# EasyEDA Pro project ProPrj_共享电动车中控.epro, board PCB5
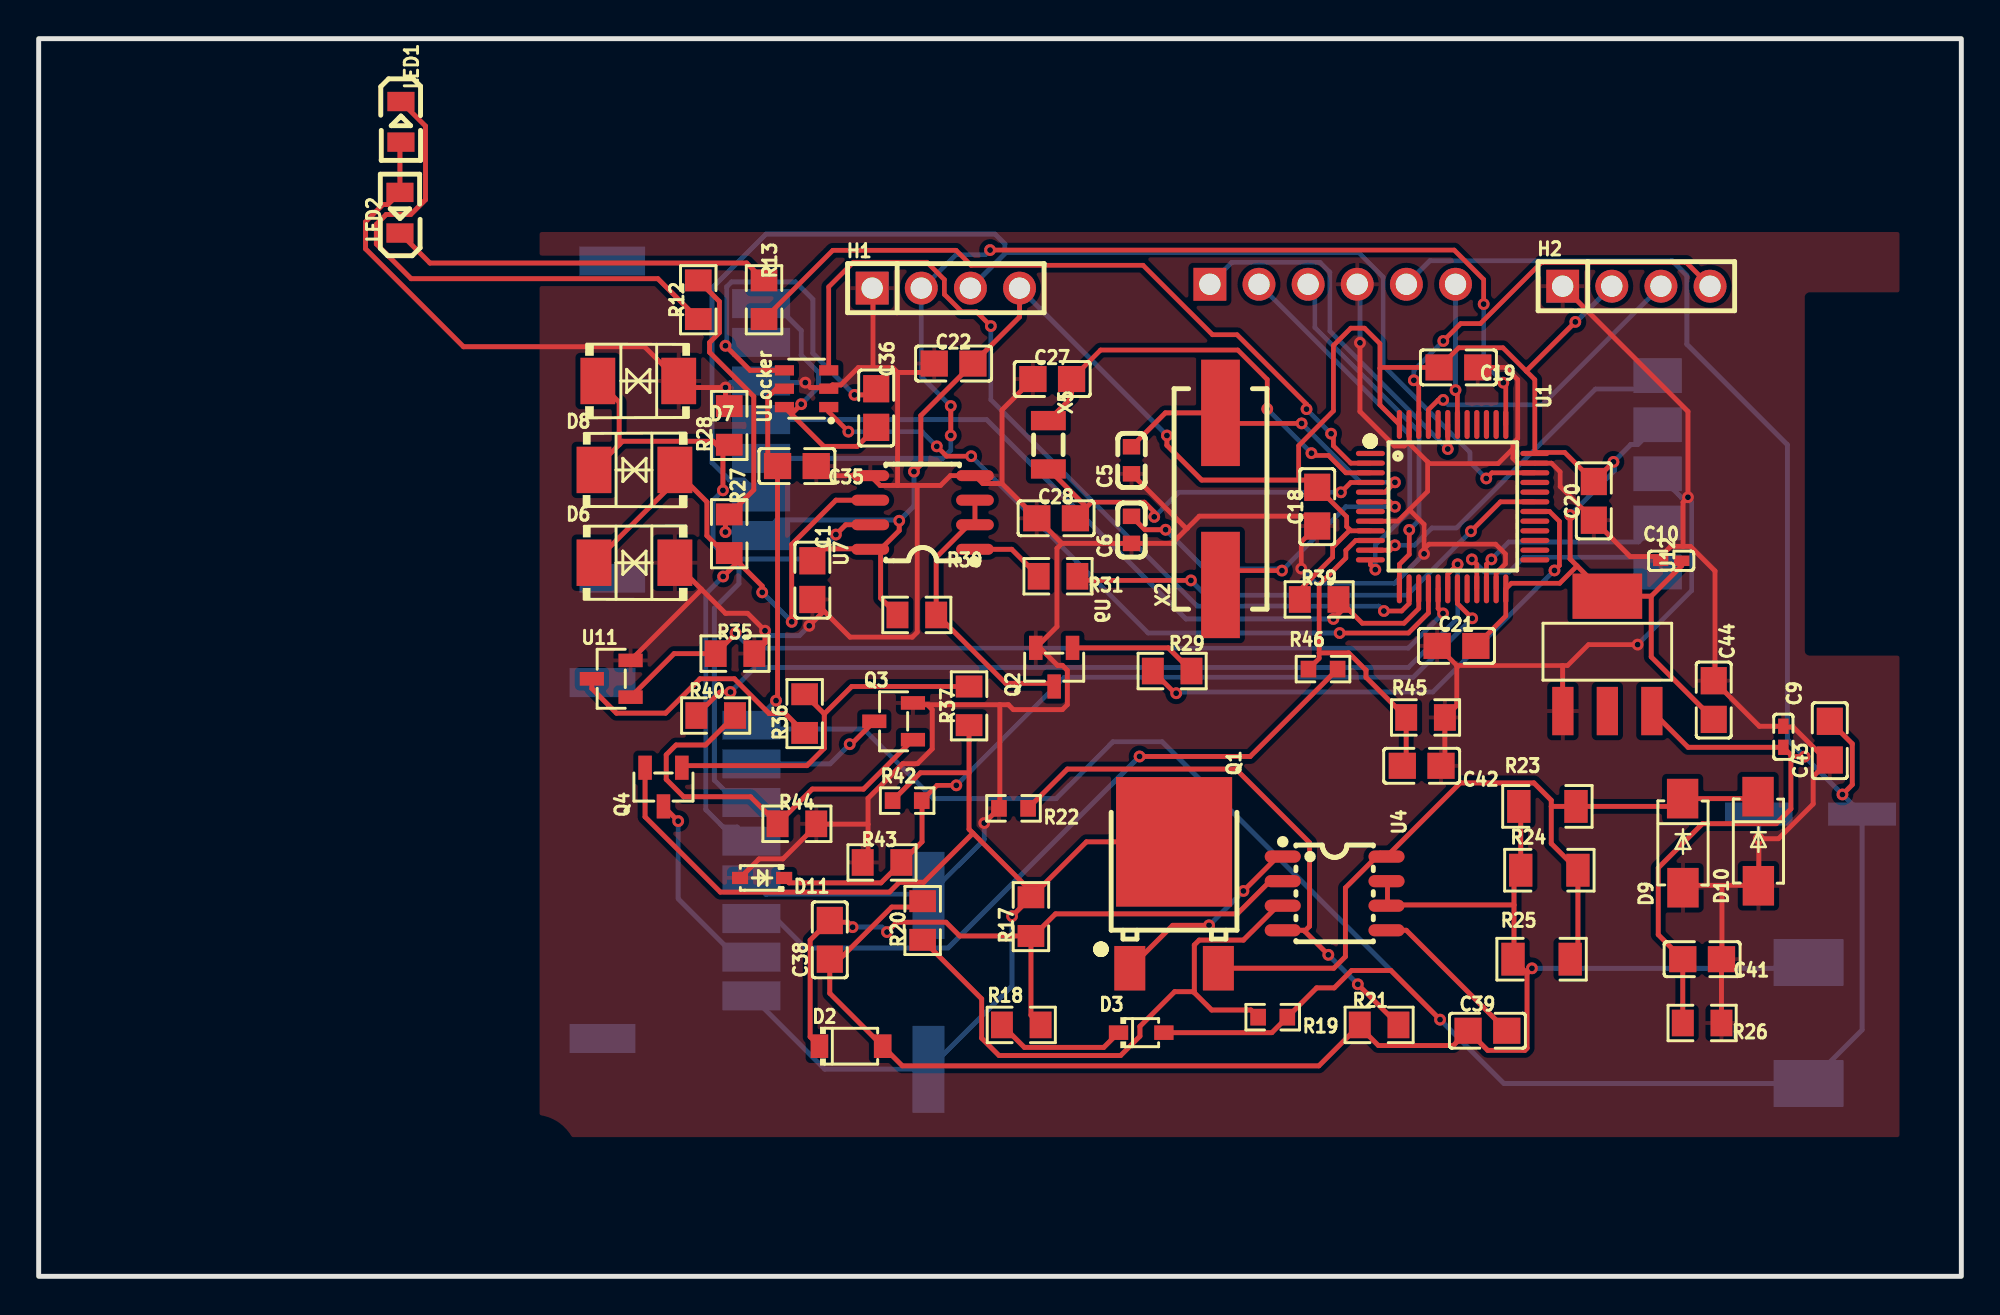
[diagram p11: board, top side]
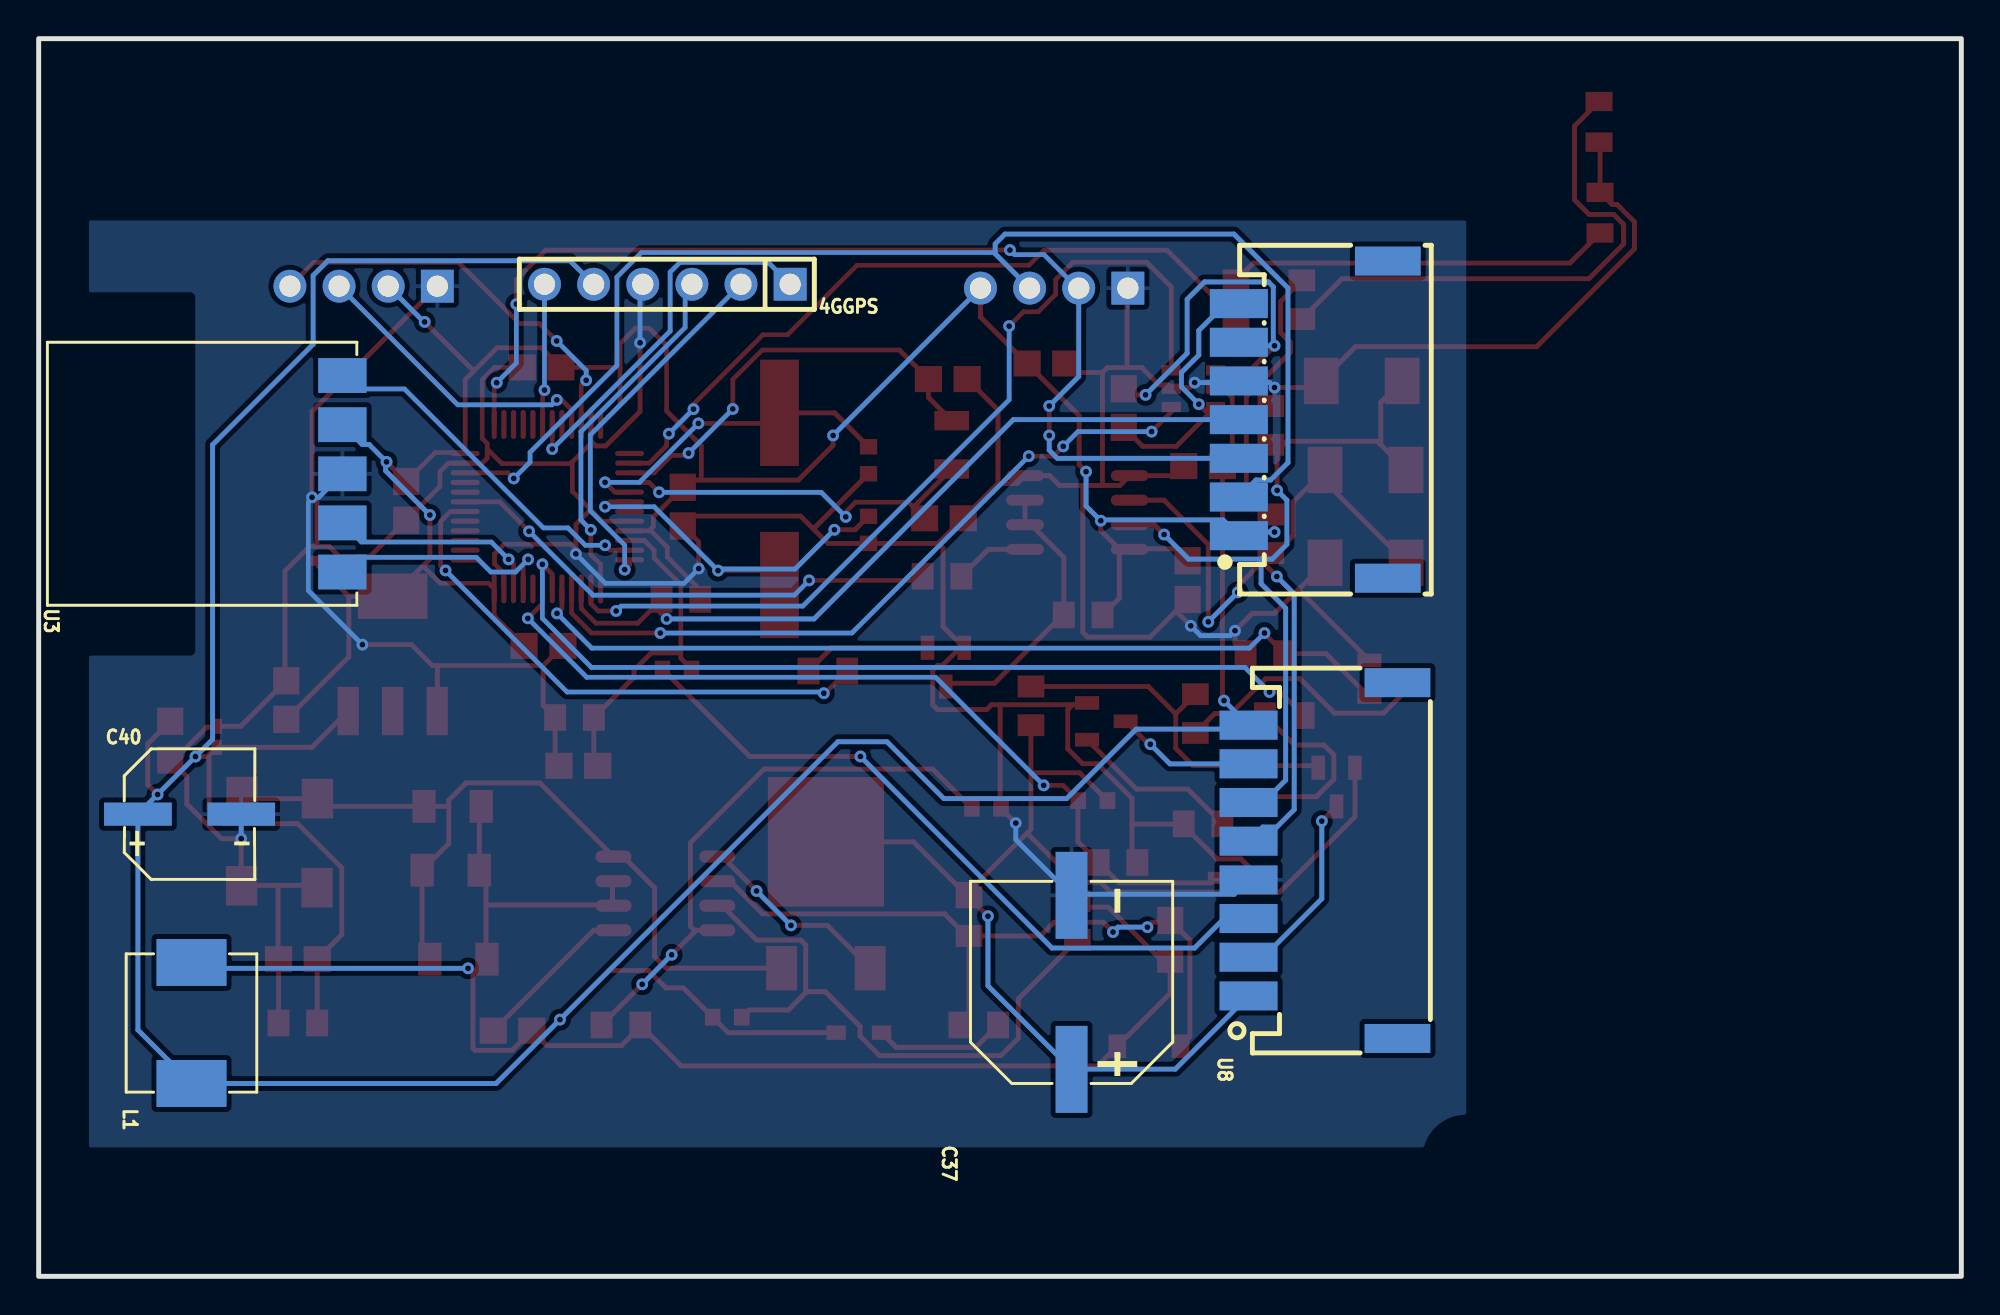
[diagram p12: board, bottom side, seen from below]

Outline 99.4 x 64 mm; copper layers: Top Layer, Bottom Layer. Coordinates in mm from the lower left corner of the outline.
Outline path: rectangle 0,64 99.4,0
Stack: Top Layer 0.035mm / Dielectric1 1.51mm FR4 er 4.5 / Bottom Layer 0.035mm

## Design rules (mm)
template: JLCPCB Capability(Two Layers Board)
spacing copperThickness1oz (default): track to track 0.102, other pairs 0.152 to 0.3
spacing copperThickness2oz: track to track 0.203, other pairs 0.152 to 0.3
track width copperThickness1oz (default): min 0.127, default 0.254, max 2.54
track width copperThickness2oz: min 0.203, default 0.254, max 2.54
differential pair differentialPair (default): width min 0.127, default 0.254, max 2.54; gap min 0.152, default 0.152
via viaSize (default): diameter min 0.5, default 0.61, max 10; hole min 0.3, default 0.305, max 6.3
net +5V uses copperThickness2oz
net GND uses copperThickness2oz
net 3V3 uses copperThickness2oz
net AGND uses copperThickness2oz
net VBAT uses copperThickness2oz
net DIANMEN uses copperThickness2oz
net VDC+ uses copperThickness2oz
net SPK1 uses copperThickness2oz
net WHEEL uses copperThickness2oz

## Placement (name value [footprint] x y rotation side)
4GGPS  X6511WV-06H-C60D30  [HDR-TH_6P-P2.54-V-M]  66.9 51.3 0 bottom
C1  100nF  [C0805]  40 36 270 top
C5  22pF  [C0603]  56.5 42.2 90 top
C6  22pF  [C0603]  56.5 38.6 90 top
C9  10uF  [C0402]  90.2 27.9 270 top
C10  10uF  [C0402]  84.4 37 0 top
C18  100nF  [C0805]  66.1 39.8 90 top
C19  100nF  [C0805]  73.4 47 180 top
C20  100nF  [C0805]  80.4 40.1 90 top
C21  100nF  [C0805]  73.3 32.6 0 top
C22  100nF  [C0805]  47.3 47.2 0 top
C27  12pF  [C0805]  52.4 46.4 0 top
C28  12pF  [C0805]  52.6 39.2 0 top
C35  4.7uF  [C0805]  39.2 41.9 180 top
C36  100nF  [C0805]  43.3 44.9 270 top
C37  47uF  [CAP-SMD_BD10.0-L10.3-W10.3-LS11.3-FD]  46 15.2 90 bottom
C38  2.2uF  [C0805]  40.9 17.4 90 top
C39  4.7uF  [C0805]  74.9 12.7 0 top
C40  220uF  [CAP-SMD_BD6.3-L6.6-W6.6-FD]  91.6 23.9 180 bottom
C41  100nF  [C0805]  86 16.4 180 top
C42  100nF  [C0805]  71.5 26.4 180 top
C43  100nF  [C0805]  92.6 27.7 90 top
C44  100nF  [C0805]  86.6 29.8 270 top
D2  BZT52B12  [SOD-123_L2.7-W1.6-LS3.7-RD]  42 11.9 0 top
D3  1N4148WS  [SOD-323_L1.8-W1.3-LS2.5-RD]  57 12.6 0 top
D6  SMBJ6.5CA  [SMB_L4.6-W3.5-LS5.3-BI]  30.8 36.9 0 top
D7  SMBJ6.5CA  [SMB_L4.6-W3.5-LS5.3-BI]  31 46.3 180 top
D8  SMBJ6.5CA  [SMB_L4.6-W3.5-LS5.3-BI]  30.8 41.7 0 top
D9  SS310  [SMA_L4.3-W2.6-LS5.0-FD]  85 22.4 90 top
D10  SS310  [SMA_L4.3-W2.6-LS5.0-FD]  88.9 22.5 90 top
D11  BZT52C3V3S  [SOD-323_L1.7-W1.3-LS2.6-RD]  37.4 20.6 180 top
H1  -  [HDR-TH_4P-P2.54-V-M]  46.9 51.1 0 top
H2  -  [HDR-TH_4P-P2.54-V-M]  82.6 51.2 0 top
L1  47uH  [IND-SMD_L7.0-W6.6_FXL0630]  91.5 13.1 90 bottom
LED1  NCD0805R1  [LED0805-R-RD]  18.73 59.7 270 top
LED2  KT-0805G  [LED0805-R-RD]  18.68 55 90 top
Q1  TX15N10B  [TO-252_L6.5-W6.1-P4.58-LS9.9-BR]  58.7 19.2 270 top
Q2  SS8050  [SOT-23-3_L2.9-W1.3-P1.90-LS2.4-BR]  52.5 31.5 90 top
Q3  SS8050  [SOT-23-3_L2.9-W1.3-P1.90-LS2.4-BR]  44.2 28.7 0 top
Q4  PJM10H01PSA  [SOT-23-3_L2.9-W1.3-P0.95-LS2.4-BR]  32.3 25.3 90 top
R12  1kΩ  [R0805]  34.1 50.5 90 top
R13  1kΩ  [R0805]  37.5 50.5 270 top
R17  51kΩ  [R0805]  51.3 18.6 90 top
R18  100Ω  [R0805]  50.8 13 0 top
R19  62kΩ  [R0603]  63.8 13.4 180 top
R20  4.99kΩ  [R0805]  45.7 18.4 90 top
R21  4.99kΩ  [R0805]  69.3 13 0 top
R22  62kΩ  [R0603]  50.4 24.2 180 top
R23  100mΩ  [R1206]  78 24.3 0 top
R24  100mΩ  [R1206]  78.1 21 0 top
R25  100mΩ  [R1206]  77.7 16.4 0 top
R26  2.2kΩ  [R0805]  86 13.1 180 top
R27  4.7kΩ  [R0805]  35.7 38.4 270 top
R28  4.7kΩ  [R0805]  35.7 44 90 top
R29  4.7kΩ  [R0805]  58.6 31.3 0 top
R30  4.7kΩ  [R0805]  45.4 34.2 180 top
R31  1kΩ  [R0805]  52.7 36.2 180 top
R35  10kΩ  [R0805]  36 32.2 0 top
R36  51kΩ  [R0805]  39.6 29.1 90 top
R37  10kΩ  [R0805]  48.1 29.5 90 top
R39  10kΩ  [R0805]  66.2 35 0 top
R40  4.7kΩ  [R0805]  35 29 0 top
R42  62kΩ  [R0603]  44.9 24.6 0 top
R43  2kΩ  [R0805]  43.6 21.4 0 top
R44  10kΩ  [R0805]  39.2 23.4 0 top
R45  10kΩ  [R0805]  71.7 28.9 0 top
R46  0Ω  [R0603]  66.4 31.4 0 top
U1  STM32F103C8T6  [LQFP-48_L7.0-W7.0-P0.50-LS9.0-BL]  73.1 39.8 270 top
U3  VG6328A  [COMM-SMD_VG6328A]  83.7 41.5 90 bottom
U4  TX4131L  [SOP-8_L4.9-W3.9-P1.27-LS6.0-BL]  67 19.8 270 top
U7  SP3485EN-L/TR  [SOIC-8_L5.0-W4.0-P1.27-LS6.0-BL]  45.7 39.5 90 top
U8  ZX-HY2.0-8PWT  [CONN-SMD_8P-P2.00_WAFER-HY2.0-8PWB]  33 21.5 90 bottom
U9  ZX-HY2.0-7PWT  [CONN-SMD_7P-P2.00_ZX-HY2.0-7PWT]  33.5 44.3 90 bottom
U11  BSS123  [SOT-23-3_L2.9-W1.3-P1.90-LS2.4-BR]  29.6 30.9 0 top
U12  AMS1117-3.3  [SOT-223-3_L6.5-W3.4-P2.30-LS7.0-BR]  81.1 32.2 270 top
ULocker  T1016H  [SOT-23-6_L2.9-W1.7-P0.95-LS2.8-BL]  39.7 45.9 90 top
X2  8MHz  [CRYSTAL-SMD_L11.5-W4.8-LS12.7]  61.1 40.2 90 top
X5  32.768kHz  [FC-135R_L3.2-W1.5]  52.2 43 270 top

## Footprints (pads in the part's own frame, mm; a bottom-side part is the same pattern mirrored in y, then rotated)
C0402
  rect 0.79x0.54 smd: 1(-0.545,0) 2(0.545,0)
C0603
  rect 0.8x0.9 smd: 1(-0.7,0) 2(0.7,0)
C0805
  rect 1.41x1.35 smd: 1(-1,0) 2(1,0)
CAP-SMD_BD6.3-L6.6-W6.6-FD
  rect 3.5x1.2 smd: 1(-2.67,0) 2(2.67,0)
CAP-SMD_BD10.0-L10.3-W10.3-LS11.3-FD
  rect 4.5x1.65 smd: 1(-4.5,0) 2(4.5,0)
COMM-SMD_VG6328A
  rect 1.8x2.5 smd: 1(-5.08,0) 2(-2.54,0) 3(0,0) 4(2.54,0) 5(5.08,0)
CONN-SMD_7P-P2.00_ZX-HY2.0-7PWT
  rect 1.5x3 smd: 1(-6,3.85) 2(-4,3.85) 3(-2,3.85) 4(0,3.85) 5(2,3.85) 6(4,3.85) 7(6,3.85)
  rect 1.5x3.4 smd: 8(8.2,-3.85) 9(-8.2,-3.85)
CONN-SMD_8P-P2.00_WAFER-HY2.0-8PWB
  rect 1.5x3 smd: 1(-7,3.85) 2(-5,3.85) 3(-3,3.85) 4(-1,3.85) 5(1,3.85) 6(3,3.85) 7(5,3.85) 8(7,3.85)
  rect 1.5x3.4 smd: 9(-9.2,-3.85) 10(9.2,-3.85)
CRYSTAL-SMD_L11.5-W4.8-LS12.7
  rect 5.5x2 smd: 1(-4.45,0) 2(4.45,0)
FC-135R_L3.2-W1.5
  rect 1x1.8 smd: 1(-1.25,0) 2(1.25,0)
HDR-TH_4P-P2.54-V-M
  rect 1.7x1.7 hole 1.1: 1(-3.81,0)
  round 1.7 hole 1.1: 2(-1.27,0) 3(1.27,0) 4(3.81,0)
HDR-TH_6P-P2.54-V-M
  rect 1.7x1.7 hole 1.1: 1(-6.35,0)
  round 1.7 hole 1.1: 2(-3.81,0) 3(-1.27,0) 4(1.27,0) 5(3.81,0) 6(6.35,0)
IND-SMD_L7.0-W6.6_FXL0630
  rect 2.424x3.62 smd: 1(3.128,0) 2(-3.128,0)
LED0805-R-RD
  rect 1x1.399 smd: 1(1.05,0) 2(-1.05,0)
LQFP-48_L7.0-W7.0-P0.50-LS9.0-BL
  oval 0.27x1.5 smd: 1(-2.75,-4.25) 2(-2.25,-4.25) 3(-1.75,-4.25) 4(-1.25,-4.25) 5(-0.75,-4.25) 6(-0.25,-4.25) 7(0.25,-4.25) 8(0.75,-4.25) 9(1.25,-4.25) 10(1.75,-4.25) 11(2.25,-4.25) 12(2.75,-4.25) 25(2.75,4.25) 26(2.25,4.25) 27(1.75,4.25) 28(1.25,4.25) 29(0.75,4.25) 30(0.25,4.25) 31(-0.25,4.25) 32(-0.75,4.25) 33(-1.25,4.25) 34(-1.75,4.25) 35(-2.25,4.25) 36(-2.75,4.25)
  oval 1.5x0.27 smd: 13(4.25,-2.75) 14(4.25,-2.25) 15(4.25,-1.75) 16(4.25,-1.25) 17(4.25,-0.75) 18(4.25,-0.25) 19(4.25,0.25) 20(4.25,0.75) 21(4.25,1.25) 22(4.25,1.75) 23(4.25,2.25) 24(4.25,2.75) 37(-4.25,2.75) 38(-4.25,2.25) 39(-4.25,1.75) 40(-4.25,1.25) 41(-4.25,0.75) 42(-4.25,0.25) 43(-4.25,-0.25) 44(-4.25,-0.75) 45(-4.25,-1.25) 46(-4.25,-1.75) 47(-4.25,-2.25) 48(-4.25,-2.75)
R0603
  rect 0.806x0.864 smd: 1(-0.753,0) 2(0.753,0)
R0805
  rect 1.133x1.377 smd: 1(-1,0) 2(1,0)
R1206
  rect 1.208x1.701 smd: 1(-1.479,0) 2(1.479,0)
SMA_L4.3-W2.6-LS5.0-FD
  rect 2.046x1.62 smd: 1(-2.304,-0.009) 2(2.304,0.009)
SMB_L4.6-W3.5-LS5.3-BI
  rect 1.8x2.4 smd: 1(-2.091,0) 2(2.091,0)
SOD-123_L2.7-W1.6-LS3.7-RD
  rect 0.91x1.22 smd: 1(-1.635,0) 2(1.635,0)
SOD-323_L1.7-W1.3-LS2.6-RD
  rect 0.83x0.63 smd: 1(-1.14,0) 2(1.14,0)
SOD-323_L1.8-W1.3-LS2.5-RD
  rect 1x0.75 smd: 1(-1.173,0) 2(1.173,0)
SOIC-8_L5.0-W4.0-P1.27-LS6.0-BL
  oval 0.569x1.95 smd: 1(-1.905,-2.705) 2(-0.635,-2.705) 3(0.635,-2.705) 4(1.905,-2.705) 5(1.905,2.705) 6(0.635,2.705) 7(-0.635,2.705) 8(-1.905,2.705)
SOP-8_L4.9-W3.9-P1.27-LS6.0-BL
  oval 0.63x1.865 smd: 1(-1.905,-2.683) 2(-0.635,-2.683) 3(0.635,-2.683) 4(1.905,-2.683) 5(1.905,2.683) 6(0.635,2.683) 7(-0.635,2.683) 8(-1.905,2.683)
SOT-23-3_L2.9-W1.3-P0.95-LS2.4-BR
  rect 1.25x0.7 smd: 1(1,-0.95) 2(1,0.95) 3(-1,0)
SOT-23-3_L2.9-W1.3-P1.90-LS2.4-BR
  rect 1.25x0.7 smd: 1(1,-0.95) 2(1,0.95) 3(-1,0)
SOT-23-6_L2.9-W1.7-P0.95-LS2.8-BL
  rect 0.532x0.99 smd: 1(-0.95,-1.145) 2(0,-1.145) 3(0.95,-1.145) 4(0.95,1.145) 5(0,1.145) 6(-0.95,1.145)
SOT-223-3_L6.5-W3.4-P2.30-LS7.0-BR
  rect 2.5x1.1 smd: 1(2.97,-2.3) 2(2.97,0) 3(2.97,2.3)
  rect 2.34x3.6 smd: 4(-2.97,0)
TO-252_L6.5-W6.1-P4.58-LS9.9-BR
  rect 2.3x1.6 smd: 1(3.268,-2.29) 3(3.267,2.29)
  rect 6.7x6 smd: 2(-3.268,0)

## Nets
As in the schematic, except:
$8N894: Q4.1 R36.2 R37.2

Pads without a net: U8 9 10; U9 8 9; U12 2

## Via types
v1: diameter 0.61, hole 0.305, Top Layer to Bottom Layer, 85 vias

## Routing (per net, layer and track width the routed paths; a pad name or vN(x,y) marks a point on that pad's centre or on a via; arc(x,y) is an arc through that point)
3V3: length 149.2
  Top Layer w0.243: 77.35,42.6 U1.36 ; 77.35,42.6 77.35,46.37 75.7,48.02 73.42,48.02 C19.2 69.39,47 69.34,46.96 ; 77.35,42.6 78.9,42.6 C20.2 ; U1.9 67.84,38.55 67.8,38.6 ; C18.2 67.62,39.28 67.62,38.77 67.8,38.6 ; 69.34,46.96 69.34,48.23 68.54,49.03 67.84,49.03 66.94,48.13 66.94,44.75 65.14,42.95 65.14,41.18 ; 69.34,46.96 69.34,45.06 U1.48 ; 79.53,36.74 78.64,35.84 76.14,35.84 U1.24 75.85,34.15 C21.2 ; 67.8,38.6 66.9,37.7 66.9,37.19 65.2,35.49 R39.1
  Top Layer w0.254: v1(79.18,39.37) 79.18,37.09 U12.4 83.37,35.17 ; v1(45.25,41.61) 45.61,41.97 45.61,44.51 C22.2 50.71,49.61 H1.4 ; R12.2 35.19,50.41 35.19,48.8 34.68,48.29 34.68,47.78 36.97,45.5 36.97,40.67 R27.1 35.5,39.2 v1(35.5,38.49) ; 43.02,37.62 43,37.59 ; 43.02,37.62 40.62,37.62 C1.1 ; 43.02,37.62 43.07,37.67 43.53,37.67 ; 76.91,46.81 v1(79.44,49.35) ; 83.37,35.17 84.94,36.75 C10.2 ; 83.37,35.17 83.37,32.03 C44.2 ; 43.53,37.67 43.53,35.07 R30.2 ; 43.53,37.67 43.59,37.67 44.49,38.56 v1(44.49,39.07) ; C20.2 v1(81.42,42.12) ; v1(58.33,43.48) 58.33,42.97 60.13,41.18 65.72,41.18 C18.2
  Bottom Layer w0.254: 44.53,39.12 38.17,39.12 37.54,38.49 ; 44.53,39.12 v1(44.49,39.07) ; 44.53,39.12 45.25,39.83 v1(45.25,41.61) ; v1(81.42,42.12) 81.46,42.16 ; 81.46,42.16 81.46,41.65 v1(79.18,39.37) ; 81.46,42.16 82.31,43.01 82.67,43.01 U3.4 ; 37.54,38.49 U9.1 ; 37.54,38.49 v1(35.5,38.49) ; v1(79.44,49.35) 79.48,49.35 H2.2 ; H1.4 v1(58.33,43.48)
+5V: length 195
  Top Layer w0.254: D3.2 63.75,12.6 R19.1 66.07,14.92 66.98,14.92 67.88,15.81 69.91,15.81 v1(72.45,13.27) ; 38.56,45.9 38.14,45.9 37.69,45.46 37.69,42.41 C35.2 38.2,29.85 v1(38.12,29.77) ; 90.59,26.96 90.59,24.17 89.83,23.41 86.02,23.41 83.73,21.12 83.73,17.67 C41.2 R26.2 ; 90.59,26.96 90.68,26.88 v1(91.29,26.88) ; 90.59,26.96 C9.2 85.28,27.36 U12.3 ; C43.2 93.76,27.54 93.76,25.42 v1(93.25,24.92)
  Bottom Layer w0.254: v1(38.12,29.77) U8.8 37.05,28.3 42.66,28.3 46.25,24.7 52.6,24.7 55.54,27.64 58.08,27.64 v1(72.45,13.27) 75.75,9.97 L1.2 94.27,12.74 C40.1 v1(93.25,24.92) v1(91.29,26.88) 90.41,27.76 90.41,43 85.21,48.2 85.21,51.76 84.45,52.52 71.93,52.52 4GGPS.5
AGND: length 83.2
  Top Layer w0.254: 76.27,19.2 76.27,20.65 76.62,21 76.62,24.2 76.52,24.3 ; 76.27,19.2 76.27,16.35 ; 76.27,19.2 69.73,19.2 ; R20.2 45.39,19.09 44.1,19.09 41.41,16.4 C38.1 40.9,14.64 D2.2 44.65,10.88 66.18,10.88 68.25,12.95 ; 76.95,15.67 76.27,16.35 ; 76.95,15.67 76.95,11.79 76.84,11.68 74.92,11.68 C39.1 73.13,11.93 69.27,11.93 68.25,12.95 ; 76.95,15.67 v1(77.2,15.93) ; 76.27,16.35 76.22,16.4 ; 69.73,19.2 69.73,20.38 U4.7 ; 69.73,19.2 69.72,19.2 U4.6 ; 68.25,12.95 R21.1
  Bottom Layer w0.254: L1.1 91.2,15.93 v1(77.2,15.93)
GND: length 319.5
  Top Layer w0.243: v1(65.28,36.6) 65.28,37.98 C18.1 ; U1.23 75.35,36.36 75.83,36.84 75.83,37.35 75.32,37.86 71.88,37.86 71.63,37.61 ; C20.1 78.66,40.84 78.66,41.6 78.21,42.05 U1.35 76.47,42.05 76.21,42.3 76.21,42.79 ; 71.63,37.61 71.63,38.88 70.86,39.64 ; 71.63,37.61 v1(71.63,37.36) ; 70.86,39.64 70.27,39.05 U1.8 ; 70.86,39.64 71.81,40.59 71.81,42.11 ; 71.81,42.11 71.9,42.03 75.45,42.03 76.21,42.79 ; 71.81,42.11 70.85,43.07 U1.47 ; v1(82.66,32.67) 80.12,32.67 79.04,31.58 73.32,31.58 C21.1 ; 76.21,42.79 76.21,43.07 76.47,43.32 76.47,46.37 75.84,47 C19.1
  Top Layer w0.254: R28.2 35.51,45.19 v1(35.51,45.96) 33.43,45.96 D7.1 31.32,48.07 21.96,48.07 16.9,53.13 16.9,54.53 17.8,55.42 18.05,55.42 LED2.1 18.68,58.6 LED1.1 ; 85.01,37.75 85.4,37.75 86.66,36.48 86.66,30.73 ; 85.01,37.75 84.38,37.75 83.85,37.22 ; 85.01,37.75 85.01,40.03 v1(85.27,40.29) 85.27,44.72 H2.1 ; 40.6,34.4 41.95,33.05 45.17,33.05 45.42,33.31 45.42,40.9 ; 40.6,34.4 v1(39.84,33.64) ; 40.6,34.4 C1.2 ; C5.1 59.32,38.68 59.38,38.68 ; 83.85,37.22 82.28,37.22 C20.1 ; 83.85,37.22 C10.1 ; D11.2 37.25,21.59 38.48,21.59 40.27,23.38 ; 73.32,31.58 73.32,29.52 R45.2 72.7,26.6 C42.1 ; v1(39.64,46.21) 39.89,45.96 40.91,45.96 ; 70.85,43.19 70.6,42.94 70.09,42.94 68.31,44.72 v1(68.31,48.27) ; 59.38,38.68 58.6,37.9 C6.1 52.9,37.9 ; 59.38,38.68 60,39.31 65.59,39.31 C18.1 ; 45.42,40.9 44.4,40.9 ; 45.42,40.9 46.63,40.9 47.13,41.41 U7.4 48.81,41 49.8,41 ; 44.4,40.9 43.5,40.9 43,41.41 40.69,41.41 C35.1 ; 44.4,40.9 44.4,46.74 ; 43.13,46.99 42.37,46.99 41.47,46.09 41.04,46.09 40.91,45.96 ; 43.13,46.99 44.15,46.99 44.4,46.74 ; 43.13,46.99 43.13,51.06 H1.1 ; 51.66,32.61 52.65,33.6 52.65,37.65 52.9,37.9 ; 51.66,32.61 52.67,31.59 52.93,31.59 53.18,31.34 53.18,29.56 52.93,29.31 50.39,29.31 50.13,29.56 49.69,29.56 ; 51.66,32.61 Q2.2 ; R44.2 40.22,23.38 40.27,23.38 ; 42.88,23.38 40.27,23.38 ; 42.88,23.38 42.88,21.68 R43.1 ; 42.88,23.38 42.88,24.72 44.67,26.51 45.44,26.51 46.2,27.27 46.2,29.31 45.94,29.56 ; 87.03,20.22 85.13,20.22 D9.1 ; 87.03,20.22 88.93,20.22 ; 87.03,20.22 87.03,16.42 C41.1 R26.1 ; Q3.2 45.29,29.56 45.94,29.56 ; R35.2 37.55,32.75 v1(37.55,33.39) 36.65,34.28 35.51,34.28 34.25,35.54 ; 44.4,46.74 45.84,46.74 C22.1 ; 88.93,20.22 v1(88.93,22.63) 89.95,22.63 91.74,24.43 91.74,25.84 92.51,26.61 ; 88.93,20.22 D10.1 ; 34.25,35.54 34.25,35.5 U11.2 ; 34.25,35.54 D6.2 ; 49.69,29.56 49.69,24.24 R22.2 v1(48.88,23.44) ; 49.69,29.56 45.94,29.56 ; C27.1 49.8,44.8 49.8,41 ; 49.8,41 C28.1 52.9,37.9 ; U12.1 78.79,29.24 78.79,31.58 ; 40.91,45.96 ULocker.2 ; 86.66,30.73 88.96,28.44 90.2,28.44 90.24,28.4 90.71,28.4 92.51,26.61 ; 86.66,30.73 C44.1 ; 92.51,26.61 C43.1
  Bottom Layer w0.243: v1(65.28,36.6) 66.04,35.83 70.1,35.83 v1(71.63,37.36) ; v1(82.66,32.67) 85.46,35.46 85.46,40.03 85.2,40.29
  Bottom Layer w0.254: v1(48.88,23.44) 48.88,22.58 46.06,19.76 ; v1(39.64,46.21) 37.44,46.21 ; 37.44,46.21 U9.5 ; 37.44,46.21 35.76,46.21 v1(35.51,45.96) ; 46.06,19.76 C37.2 ; 46.06,19.76 37.59,19.76 U8.4 ; v1(85.27,40.29) 84.91,40.29 U3.3 ; C40.2 v1(88.93,22.63) ; v1(39.84,33.64) 39.33,33.13 37.8,33.13 v1(37.55,33.39) ; 4GGPS.4 68.31,51.16 v1(68.31,48.27)
485A: length 42.4
  Top Layer w0.254: 43,40.14 41.22,40.14 38.93,37.85 v1(38.93,33.84) ; v1(37.41,35.37) 37.41,35.69 36.15,36.95 ; 36.15,36.95 v1(35.39,36.19) ; 36.15,36.95 R27.2 35.45,37.4 34.55,38.3 34.55,40.04 33.16,41.44 ; 33.16,41.44 33.16,41.35 D6.1 ; 33.16,41.44 D8.2
  Bottom Layer w0.254: v1(38.93,33.84) v1(37.41,35.37) ; v1(35.39,36.19) 34.49,35.29 34.49,24.13 35.39,23.23 36.12,23.23 U8.5
485B: length 40.3
  Top Layer w0.254: 43,38.86 41.72,38.86 v1(41.22,38.36) ; 30.01,43 30.19,43.18 34.87,43.18 35.38,42.67 ; 30.01,43 D8.1 ; 30.01,43 30.01,45.2 D7.2 ; v1(35.38,40.64) 35.38,42.67 ; 35.38,42.67 R28.1
  Bottom Layer w0.254: U8.6 36.59,24.76 35.83,24.76 34.93,25.66 34.93,34.55 36.2,35.82 36.2,37.09 ; 36.2,37.09 35.63,37.09 34.87,37.85 34.87,40.14 v1(35.38,40.64) ; 36.2,37.09 39.95,37.09 v1(41.22,38.36)
DIANMEN: length 10.1
  Top Layer w0.254: Q4.3 v1(33.06,23.54)
  Bottom Layer w0.254: v1(33.06,23.54) 33.06,19.53 35.76,16.83 36.52,16.83 U8.2
LOCKER1(RED): length 13.9
  Top Layer w0.254: 38.91,44.59 40.59,42.92 42.32,42.92 C36.2 ; 38.91,44.59 v1(39.42,45.1) ; 38.91,44.59 38.56,44.95
  Bottom Layer w0.254: v1(39.42,45.1) 40.32,46 40.32,46.74 39.42,47.64 39.42,48.91 38.52,49.81 37.84,49.81 U9.7
LOCKER2(BLACK): length 20.6
  Top Layer w0.254: C36.1 42.98,45.58 v1(42.17,45.58) ; v1(35.51,48.12) 36.78,46.85 38.56,46.85
  Bottom Layer w0.254: 35.57,48.12 35.57,51.17 35.82,51.42 39.13,51.42 40.02,50.52 40.02,47.73 v1(42.17,45.58) ; 35.57,48.12 v1(35.51,48.12) ; 35.57,48.12 37.17,48.12 U9.6
OSC32_IN: length 22.2
  Top Layer w0.243: v1(65.8,42.57) 65.92,42.45 66.68,42.45 67.58,41.55 U1.3 ; v1(63.52,44.85) 63.52,46.38 61.99,47.9 54.9,47.9 C27.2
  Top Layer w0.254: X5.1 53.4,45.45 C27.2
  Bottom Layer w0.243: v1(65.8,42.57) v1(63.52,44.85)
OSC32_OUT: length 19.6
  Top Layer w0.243: U1.4 67.83,41.05 v1(67.33,40.54) ; v1(57.67,39.27) 57.67,39.53 57.17,40.03 54.43,40.03 54.13,39.73 C28.2
  Top Layer w0.254: X5.2 54.13,39.82 54.13,39.73
  Bottom Layer w0.243: v1(57.67,39.27) 58.94,40.54 v1(67.33,40.54)
OSC_IN: length 17.3
  Top Layer w0.243: v1(65.29,44.11) 61.64,44.11 X2.2 ; U1.5 69.61,40.55 v1(70.12,41.06)
  Top Layer w0.254: C5.2 58.25,44.65 X2.2
  Bottom Layer w0.243: v1(65.29,44.11) 68.34,41.06 v1(70.12,41.06)
OSC_OUT: length 21.1
  Top Layer w0.243: U1.6 69.87,40.05 v1(70.12,39.8) ; v1(64.28,36.49) 61.84,36.49 X2.1
  Top Layer w0.254: v1(58.26,38.61) 57.19,38.61 C6.2
  Bottom Layer w0.243: v1(70.12,39.8) 67.58,39.8 64.36,36.57 v1(64.28,36.49)
  Bottom Layer w0.254: 64.36,36.57 60.29,36.57 v1(58.26,38.61)
PA0: length 17.1
  Top Layer w0.243: R46.1 66.2,31.95 66.2,35.76 67.58,37.14 67.58,37.54 68.09,38.05 U1.10
  Top Layer w0.254: C42.2 70.7,26.6 R45.1 68.62,30.98 68.62,31.34 67.72,32.24 66.2,32.24
PA1: length 18.6
  Top Layer w0.243: v1(70.12,37.8) 69.87,37.55 U1.11
  Bottom Layer w0.243: U3.5 83.01,45.89 80.49,45.89 73.3,38.7 72.03,38.7 71.14,37.8 v1(70.12,37.8)
PA2: length 19.3
  Top Layer w0.243: v1(69.1,36.54) 68.85,36.8 U1.12
  Bottom Layer w0.243: 4GGPS.2 70.88,43.51 70.88,39.59 69.1,37.81 v1(69.1,36.54)
PA3: length 18.5
  Top Layer w0.243: v1(70.86,38.6) 70.86,37.33 70.35,36.82 U1.13
  Bottom Layer w0.243: v1(70.86,38.6) 71.37,39.11 71.37,43.68 65.98,49.07 65.98,50.95 4GGPS.3
PA4: length 45.9
  Top Layer w0.243: v1(49.23,49.14) 48.48,49.88 47.72,49.88 46.82,50.78 46.82,51.54 45.93,52.44 42.12,52.44 40.84,51.17 ULocker.3 ; v1(69.55,34.4) 70.47,34.4 70.85,34.79 U1.14
  Bottom Layer w0.243: v1(69.55,34.4) 69.29,34.66 59.9,34.66 49.23,45.33 v1(49.23,49.14)
PA5: length 40.8
  Top Layer w0.243: U1.15 71.35,34.53 70.59,33.77 68.43,33.77 R39.2
  Top Layer w0.254: v1(66.94,33.99) 67.44,34.5 67.7,34.5
  Bottom Layer w0.254: U9.4 49.01,44.3 59.32,33.99 v1(66.94,33.99)
PA6: length 37.7
  Top Layer w0.243: ULocker.1 40.84,44.7 v1(41.86,43.68) ; v1(67.26,33.27) 70.82,33.27 71.85,34.3 U1.16 ; v1(46.43,42.92) 46.94,42.41 v1(48.21,42.41)
  Bottom Layer w0.243: v1(41.86,43.68) 45.67,43.68 v1(46.43,42.92) ; v1(48.21,42.41) 57.35,33.27 v1(67.26,33.27)
PA7: length 45.8
  Top Layer w0.243: v1(72.6,34.28) 72.35,34.53 U1.17 ; v1(36.03,33.26) 36.03,33.23 R35.1
  Top Layer w0.254: R35.1 32.85,32.2 U11.1
  Bottom Layer w0.243: v1(72.6,34.28) 70.81,32.48 36.81,32.48 v1(36.03,33.26)
PA9/USART1_TX: length 28
  Top Layer w0.243: U1.30 78.11,39.55 78.62,39.04 78.62,36.76 v1(78.37,36.5) ; v1(58.81,30.15) 58.75,30.15 R29.1
  Bottom Layer w0.243: v1(78.37,36.5) 72.08,30.22 58.87,30.22 v1(58.81,30.15)
PA10/USART1_RX: length 26.1
  Top Layer w0.243: v1(59.57,35.99) 53.91,35.99 R31.1 ; U1.31 75.57,40.05 v1(74.05,38.53)
  Bottom Layer w0.243: v1(59.57,35.99) 60.33,35.22 70.75,35.22 v1(74.05,38.53)
PA13/SWDIO: length 67.2
  Top Layer w0.243: v1(74.84,41.26) 75.13,41.55 U1.34
  Bottom Layer w0.243: 49.95,52.94 68.24,52.94 69.51,51.67 69.51,47.1 74,42.61 74,42.1 v1(74.84,41.26)
  Bottom Layer w0.254: H1.3 49.95,52.88 49.95,53.39 49.44,53.89 37.6,53.89 34.81,51.1 34.81,42.08 35.71,41.18 36.47,41.18 U9.2
PA14/SWCLK: length 57.5
  Top Layer w0.243: v1(49.19,53.07) 73.18,53.07 74.71,51.54 v1(74.71,50.27) ; v1(75.72,46.21) 75.85,46.08 U1.37
  Top Layer w0.254: v1(47.15,45) v1(47.15,43.48)
  Bottom Layer w0.243: v1(75.72,46.21) 74.71,47.23 v1(74.71,50.27) ; v1(49.19,53.07) 48.95,52.83 47.43,52.83 45.63,51.04
  Bottom Layer w0.254: v1(47.15,45) 45.63,46.53 H1.2 ; v1(47.15,43.48) 47.15,42.72 46.74,42.3 U9.3
PB0: length 45.7
  Top Layer w0.243: R40.1 35.22,30.22 v1(35.77,30.22) ; v1(73.36,36.82) 72.85,36.31 U1.18
  Bottom Layer w0.243: v1(73.36,36.82) 73.36,34.03 70.82,31.49 37.04,31.49 v1(35.77,30.22)
PB1: length 44.5
  Top Layer w0.243: v1(47.44,25.39) 46.44,25.39 45.67,24.62 R42.2 ; v1(74.11,34.03) 73.35,34.79 U1.19
  Top Layer w0.254: D11.1 38.79,20.35 43.55,20.35 R43.2 45.67,22.47 45.67,24.62
  Bottom Layer w0.243: v1(74.11,34.03) 71.06,30.98 53.03,30.98 v1(47.44,25.39)
PB6: length 7.3
  Top Layer w0.243: v1(73.25,45.83) 73.35,45.73 U1.42
  Bottom Layer w0.243: v1(73.25,45.83) 4GGPS.6
PB7: length 19.8
  Top Layer w0.243: U1.43 v1(72.85,42.78)
  Bottom Layer w0.243: 4GGPS.1 61.68,52.43 66.25,52.43 66.75,51.92 66.75,48.88 v1(72.85,42.78)
PB8: length 15.6
  Top Layer w0.243: v1(72.61,45.32) 72.36,45.32 71.85,44.81 U1.45
  Bottom Layer w0.243: v1(72.61,45.32) 72.87,45.07 77.74,45.07 H2.3
PB9: length 21
  Top Layer w0.243: v1(71.1,46.34) 71.35,46.08 U1.46 ; H2.4 85.18,52.43 77.7,52.43 74.53,49.27 73.52,49.27 v1(72.62,48.37)
  Bottom Layer w0.243: v1(71.1,46.34) 71.1,46.84 v1(72.62,48.37)
PB10: length 12.1
  Top Layer w0.243: v1(74.1,37.07) 74.35,36.82 U1.21
  Bottom Layer w0.243: v1(74.1,37.07) 74.75,36.42 76.02,36.42 76.78,37.18 82.94,37.18 U3.1
PB11: length 11
  Top Layer w0.243: U1.22 74.85,36.82 v1(75.1,37.07)
  Bottom Layer w0.243: U3.2 82.71,37.97 76,37.97 v1(75.1,37.07)
PC13: length 37.8
  Top Layer w0.243: U1.2 67.83,42.05 66.94,42.95 66.94,43.46 v1(66.82,43.57) ; v1(65.55,44.84) 65.55,45.1 61.96,48.69 60.69,48.69 57.09,52.28 48.2,52.28 47.43,53.06 41.06,53.06 R13.2
  Bottom Layer w0.243: v1(66.82,43.57) v1(65.55,44.84)
SPK1: length 7.3
  Top Layer w0.254: v1(41.93,27.52) 42.02,27.52 Q3.3
  Bottom Layer w0.254: U8.7 40.91,26.5 v1(41.93,27.52)
VDC+: length 67.8
  Top Layer w0.254: 48.1,26.04 48.1,23.12 48.3,22.92 ; 48.1,26.04 45.59,26.04 R42.1 ; 48.1,26.04 R37.1 ; 51.97,20.27 R17.2 v1(50.32,18.62) ; 51.97,20.27 50.95,20.27 48.3,22.92 ; 51.97,20.27 54.17,22.47 Q1.2 ; 48.3,22.92 45.76,20.38 44.49,20.38 43.98,19.87 35.24,19.87 31.35,23.76 Q4.2
  Bottom Layer w0.254: 46.01,10.71 C37.1 ; 46.01,10.71 50.32,15.02 v1(50.32,18.62) ; 46.01,10.71 40.64,10.71 U8.1
WHEEL: length 36.9
  Top Layer w0.254: R46.2 62.64,26.88 v1(56.92,26.88)
  Bottom Layer w0.254: U8.3 38.12,18.5 39.64,16.98 47.01,16.98 v1(56.92,26.88)
$1N2074: length 27.9
  Top Layer w0.254: LED1.2 20,59.48 20,55.67 19.24,54.91 17.97,54.91 17.46,54.4 17.46,53.38 19.25,51.59 32.01,51.59 R12.1
$1N2077: length 19.8
  Top Layer w0.254: R13.1 36.6,52.4 20.23,52.4 LED2.2
$4N4676: length 8.4
  Top Layer w0.254: C39.2 70.71,17.89 U4.5
$4N4693: length 31.1
  Top Layer w0.254: R19.2 62.68,13.77 60.64,13.77 59.75,14.67 59.75,14.72 ; 59.75,14.72 59.75,17.13 60,17.39 62.29,17.39 64.06,19.17 U4.3 ; 59.75,14.72 58.73,14.72 56.93,12.92 56.93,12.42 55.94,11.42 49.65,11.42 48.75,12.32 48.75,14.35 R20.1
$4N4698: length 10.3
  Top Layer w0.254: U4.1 64.06,21.7 v1(62.29,19.93) ; v1(60.51,18.15) 58.63,18.15 Q1.1
  Bottom Layer w0.254: v1(62.29,19.93) v1(60.51,18.15)
$4N4701: length 29.7
  Top Layer w0.254: R22.1 53.19,26.23 61.89,26.23 65.7,22.42 65.7,18.1 65.45,17.85 ; 65.45,17.85 v1(66.68,16.62) ; 65.45,17.85 65.41,17.89 U4.4 ; v1(68.2,15.1) R21.2
  Bottom Layer w0.254: v1(66.68,16.62) v1(68.2,15.1)
$4N4703: length 37.4
  Top Layer w0.254: v1(42.08,18.06) 41.83,18.31 40.81,18.31 ; R18.2 51.3,13.5 51.3,17.47 ; 40.81,18.31 39.88,17.38 39.88,12.38 D2.1 ; 40.81,18.31 C38.2 ; 51.3,17.47 R17.1 47.62,17.6 46.91,18.31 44.37,18.31 v1(43.86,17.8) ; 51.3,17.47 52.57,18.74 61.97,18.74 63.66,20.44 U4.2
  Bottom Layer w0.254: v1(42.08,18.06) 43.6,18.06 v1(43.86,17.8)
$4N4719: length 6.8
  Top Layer w0.254: D3.1 55.07,11.84 50.96,11.84 R18.1
$4N4723: length 43.7
  Top Layer w0.254: D10.2 88.79,24.7 D9.2 84.59,24.3 R23.2 78.2,24.3 ; Q1.3 66.96,15.93 67.56,16.53 67.56,20.09 69.35,21.88 69.86,21.88 ; 78.2,24.3 78.2,22.38 R24.2 79.58,16.8 R25.2 ; 78.2,24.3 78.2,24.62 77.3,25.52 73.49,25.52 69.86,21.88 ; 69.86,21.88 U4.8
$6N472: length 14.6
  Top Layer w0.254: Q2.3 52.34,30.66 49.99,30.66 46.4,34.26 ; 48.41,38.93 48.15,38.93 46.4,37.18 46.4,34.26 ; 48.41,38.93 U7.2 ; 48.41,38.93 U7.3 ; 46.4,34.26 R30.1
$6N475: length 3.9
  Top Layer w0.254: R31.2 50.31,37.59 U7.1
$6N478: length 6.6
  Top Layer w0.254: R29.2 58.4,32.5 Q2.1
$8N894: length 19.1
  Top Layer w0.254: 40.62,29.08 42.03,30.5 R37.2 ; 40.62,29.08 40.62,27.31 39.72,26.41 33.36,26.41 Q4.1 ; 40.62,29.08 R36.2
$8N1397: length 13.9
  Top Layer w0.254: U11.3 28.6,30.39 29.87,29.12 32.41,29.12 34.19,30.9 35.97,30.9 37.76,29.1 38.6,29.1 R36.1
$11N115: length 21.2
  Top Layer w0.254: R40.2 34.48,27.48 32.95,27.48 32.44,26.97 32.44,25.7 33.34,24.8 36.8,24.8 R44.1 40,25.2 42.65,25.2 Q3.1

## Copper pours and planes (outline as drawn; the poured copper is in the pictures)
GND on Top Layer: 25.9,54 96.2,54 96.2,7.2 25.9,7.2
GND on Bottom Layer: 25.6,54.6 96.8,54.6 96.8,6.67 25.6,6.67

Small or netless copper shapes (teardrops, artwork), in the pictures only: 1 on Top Layer
